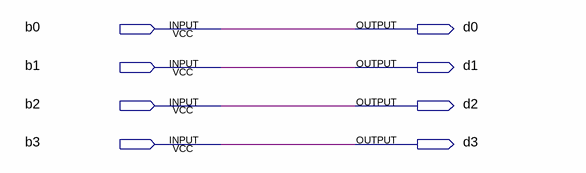
[diagram p0: schematic sheet]
// Quartus schematic Tastenentpreller.bdf as structural Verilog: 0 symbols, 8 pins
module Tastenentpreller (
  input  b0,
  input  b1,
  input  b2,
  input  b3,
  output d0,
  output d1,
  output d2,
  output d3
);


  assign d0 = b0;
  assign d1 = b1;
  assign d2 = b2;
  assign d3 = b3;
endmodule
